# Altium project controller.PrjPcb
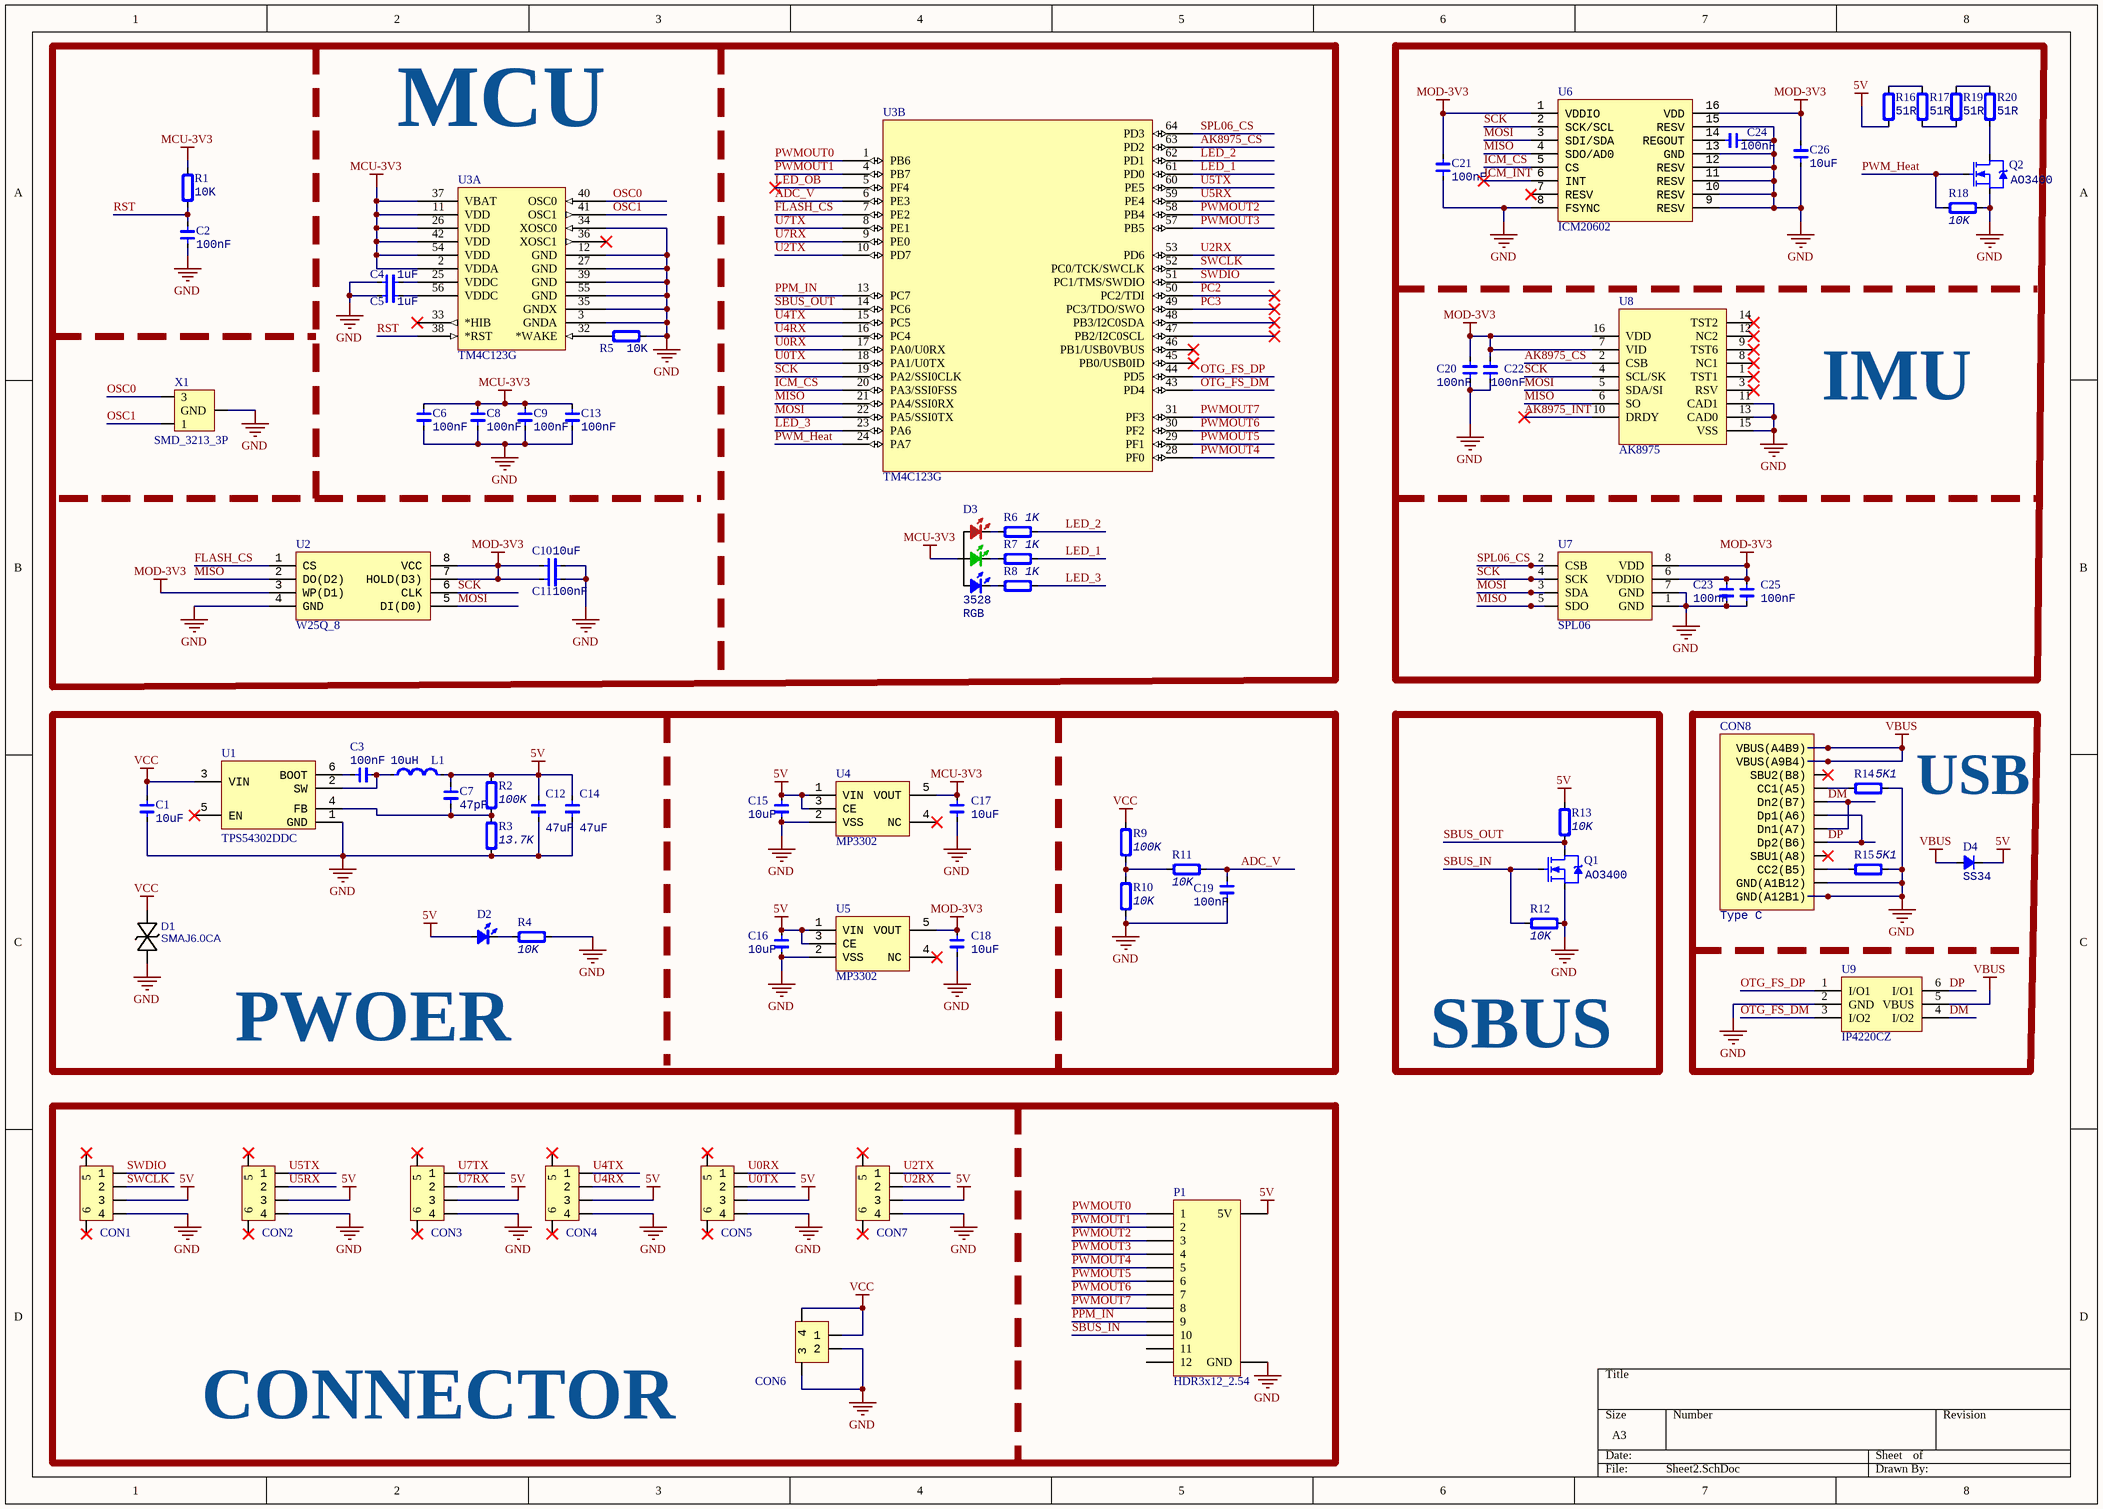
[diagram p0: Sheet2.SchDoc]
1 sheet, 72 parts. Net scope: global (net labels, ports and power ports of the same name join across sheets).
Board file: PCB1.PcbDoc

## Sheet Sheet2.SchDoc
size A3

### Parts
C1  value 10uF  [CAP_0805]  (hidden comment: C0805)
C2  value 100nF  [CAP_0603]  (hidden comment: C0603)
C3  value 100nF  [CAP_0603]  (hidden comment: C0603)
C4  value 1uF  [CAP_0603]  (hidden comment: C0603)
C5  value 1uF  [CAP_0603]  (hidden comment: C0603)
C6  value 100nF  [CAP_0603]  (hidden comment: C0603)
C7  value 47pF  [CAP_0603]  (hidden comment: C0603)
C8  value 100nF  [CAP_0603]  (hidden comment: C0603)
C9  value 100nF  [CAP_0603]  (hidden comment: C0603)
C10  value 10uF  [CAP_0603]  (hidden comment: C0603)
C11  value 100nF  [CAP_0603]  (hidden comment: C0603)
C12  value 47uF  [CAP_0603]  (hidden comment: C0603)
C13  value 100nF  [CAP_0603]  (hidden comment: C0603)
C14  value 47uF  [CAP_0603]  (hidden comment: C0603)
C15  value 10uF  [CAP_0603]  (hidden comment: C0603)
C16  value 10uF  [CAP_0603]  (hidden comment: C0603)
C17  value 10uF  [CAP_0603]  (hidden comment: C0603)
C18  value 10uF  [CAP_0603]  (hidden comment: C0603)
C19  value 100nF  [CAP_0603]  (hidden comment: C0603)
C20  value 100nF  [CAP_0603]  (hidden comment: C0603)
C21  value 100nF  [CAP_0603]  (hidden comment: C0603)
C22  value 100nF  [CAP_0603]  (hidden comment: C0603)
C23  value 100nF  [CAP_0603]  (hidden comment: C0603)
C24  value 100nF  [CAP_0603]  (hidden comment: C0603)
C25  value 100nF  [CAP_0603]  (hidden comment: C0603)
C26  value 10uF  [CAP_0603]  (hidden comment: C0603)
CON1  GH1.25_4P  [GH1.25_4P卧贴]  (value not drawn)
CON2  GH1.25_4P  [GH1.25_4P卧贴]  (value not drawn)
CON3  GH1.25_4P  [GH1.25_4P卧贴]  (value not drawn)
CON4  GH1.25_4P  [GH1.25_4P卧贴]  (value not drawn)
CON5  GH1.25_4P  [GH1.25_4P卧贴]  (value not drawn)
CON6  GH1.25_2P  [GH1.25-2P]  (value not drawn)
CON7  GH1.25_4P  [GH1.25_4P卧贴]  (value not drawn)
CON8  value Type C  [USB_TypeC_SMD_16P]  (hidden comment: USB Type C)
D1  SMAJ6.0CA  [DO-214AC]
D2  D0603  [LED_0603_RED]  (value not drawn)
D3  value RGB  Type: 3528  [LED_3528_RGB]  (hidden comment: D3528)
D4  SS34  [DO-214AC]
L1  value 10uH  [IND_0630]  (hidden comment: H1008)
P1  HDR3x12_2.54  [HDR3x12_2.54]
Q1  AO3400  [SOT23-3]
Q2  AO3400  [SOT23-3]
R1  value 10K  [RES_0603]  (hidden comment: R0603)
R2  value 100K  [RES_0603]  (hidden comment: R0603)
R3  value 13.7K  [RES_0603]  (hidden comment: R0603)
R4  value 10K  [RES_0603]  (hidden comment: R0603)
R5  value 10K  [RES_0603]  (hidden comment: R0603)
R6  value 1K  [RES_0603]  (hidden comment: R0603)
R7  value 1K  [RES_0603]  (hidden comment: R0603)
R8  value 1K  [RES_0603]  (hidden comment: R0603)
R9  value 100K  [RES_0603]  (hidden comment: R0603)
R10  value 10K  [RES_0603]  (hidden comment: R0603)
R11  value 10K  [RES_0603]  (hidden comment: R0603)
R12  value 10K  [RES_0603]  (hidden comment: R0603)
R13  value 10K  [RES_0603]  (hidden comment: R0603)
R14  value 5K1  [RES_0603]  (hidden comment: R0603)
R15  value 5K1  [RES_0603]  (hidden comment: R0603)
R16  value 51R  [RES_0805]  (hidden comment: R0805)
R17  value 51R  [RES_0805]  (hidden comment: R0805)
R18  value 10K  [RES_0603]  (hidden comment: R0603)
R19  value 51R  [RES_0805]  (hidden comment: R0805)
R20  value 51R  [RES_0805]  (hidden comment: R0805)
U1  TPS54302DDC  [SOT23-6]
U2  W25Q_8  [SON_P1.27H_8]
U3  TM4C123G  [LQFP_P0.5_64]  (parts A,B of 2)
U4  MP3302  [SOT23-5]
U5  MP3302  [SOT23-5]
U6  ICM20602  [LGA_P0.5_16]
U7  SPL06  [SMD_8P-2x2.5]
U8  AK8975  [QFN_P0.65_16]
U9  IP4220CZ  [SOT23-6]
X1  SMD_3213_3P  [XT_3213_3]

### Blocks framed on the sheet
MCU: C2 C4-C6 C8-C11 C13 D3 R1 R5-R8 U2 U3 X1
IMU: C20-C26 Q2 R16-R20 U6-U8
PWOER: C1 C3 C7 C12 C14-C19 D1 D2 L1 R2-R4 R9-R11 U1 U4 U5
SBUS: Q1 R12 R13
USB: CON8 D4 R14 R15 U9
CONNECTOR: CON1-CON7 P1

### Nets
5V: C7.1 C12.2 C14.2 C15.2 C16.2 CON1.3 CON2.3 CON3.3 CON4.3 CON5.3 CON7.3 D2.1(A) D4.2(K) L1.2 P1.13(5V) R2.2 R13.2 R16.1 U4.1(VIN) U4.3(CE) U5.1(VIN) U5.3(CE)
GND: C1.1 C2.1 C4.2 C5.2 C6.1 C8.1 C9.1 C10.2 C11.1 C12.1 C13.1 C14.1 C15.1 C16.1 C17.1 C18.1 C19.2 C20.2 C21.2 C22.2 C23.2 C24.1 C25.2 C26.2 CON1.4 CON2.4 CON3.4 CON4.4 CON5.4 CON6.2 CON6.3 CON7.4 CON8.1(GND(A1B12)) CON8.12(GND(A12B1)) D1.1(C) P1.14(GND) Q1.1(S) Q2.1(S) R3.1 R4.2 R5.1 R10.1 R12.2 R14.1 R15.1 R18.2 U1.1(GND) U2.4(GND) U3.3(GNDA) U3.12(GND) U3.27(GND) U3.34(XOSC0) U3.35(GNDX) U3.39(GND) U3.55(GND) U4.2(VSS) U5.2(VSS) U6.8(FSYNC) U6.9(RESV) U6.10(RESV) U6.11(RESV) U6.12(RESV) U6.13(GND) U6.15(RESV) U7.1(GND) U7.7(GND) U8.11(CAD1) U8.13(CAD0) U8.15(VSS) U9.2(GND) X1.2(GND)
MCU-3V3: C6.2 C8.2 C9.2 C13.2 C17.2 D3.4(A) R1.2 U3.2(VDDA) U3.11(VDD) U3.26(VDD) U3.37(VBAT) U3.42(VDD) U3.54(VDD) U4.5(VOUT)
MOD-3V3: C10.1 C11.2 C18.2 C20.1 C21.1 C22.1 C23.1 C25.1 C26.1 U2.3(WP(D1)) U2.7(HOLD(D3)) U2.8(VCC) U5.5(VOUT) U6.1(VDDIO) U6.16(VDD) U7.6(VDDIO) U7.8(VDD) U8.7(VID) U8.16(VDD)
VBUS: CON8.2(VBUS(A4B9)) CON8.11(VBUS(A9B4)) D4.1(A) U9.5(VBUS)
VCC: C1.2 CON6.1 CON6.4 D1.2(A) R9.2 U1.3(VIN)
ADC_V: C19.1 R11.1 U3.6(PE3)
AK8975_CS: U3.63(PD2) U8.2(CSB)
AK8975_INT: U8.10(DRDY)
DM: CON8.5(Dn2(B7)) CON8.7(Dn1(A7)) U9.4(I/O2)
DP: CON8.6(Dp1(A6)) CON8.8(Dp2(B6)) U9.6(I/O1)
FLASH_CS: U2.1(CS) U3.7(PE2)
ICM_CS: U3.20(PA3/SSI0FSS) U6.5(CS)
ICM_INT: U6.6(INT)
LED_1: R7.1 U3.61(PD0)
LED_2: R6.1 U3.62(PD1)
LED_3: R8.1 U3.23(PA6)
LED_OB: U3.5(PF4)
MISO: U2.2(DO(D2)) U3.21(PA4/SSI0RX) U6.4(SDO/AD0) U7.5(SDO) U8.6(SO)
MOSI: U2.5(DI(D0)) U3.22(PA5/SSI0TX) U6.3(SDI/SDA) U7.3(SDA) U8.5(SDA/SI)
OSC0: U3.40(OSC0) X1.3
OSC1: U3.41(OSC1) X1.1
OTG_FS_DM: U3.43(PD4) U9.3(I/O2)
OTG_FS_DP: U3.44(PD5) U9.1(I/O1)
PC2: U3.50(PC2/TDI)
PC3: U3.49(PC3/TDO/SWO)
PPM_IN: P1.9 U3.13(PC7)
PWM_Heat: Q2.2(G) R18.1 U3.24(PA7)
PWMOUT0: P1.1 U3.1(PB6)
PWMOUT1: P1.2 U3.4(PB7)
PWMOUT2: P1.3 U3.58(PB4)
PWMOUT3: P1.4 U3.57(PB5)
PWMOUT4: P1.5 U3.28(PF0)
PWMOUT5: P1.6 U3.29(PF1)
PWMOUT6: P1.7 U3.30(PF2)
PWMOUT7: P1.8 U3.31(PF3)
RST: C2.2 R1.1 U3.38(*RST)
SBUS_IN: P1.10 Q1.2(G) R12.1
SBUS_OUT: Q1.3(D) R13.1 U3.14(PC6)
SCK: U2.6(CLK) U3.19(PA2/SSI0CLK) U6.2(SCK/SCL) U7.4(SCK) U8.4(SCL/SK)
SPL06_CS: U3.64(PD3) U7.2(CSB)
SWCLK: CON1.2 U3.52(PC0/TCK/SWCLK)
SWDIO: CON1.1 U3.51(PC1/TMS/SWDIO)
U0RX: CON5.1 U3.17(PA0/U0RX)
U0TX: CON5.2 U3.18(PA1/U0TX)
U2RX: CON7.2 U3.53(PD6)
U2TX: CON7.1 U3.10(PD7)
U4RX: CON4.2 U3.16(PC4)
U4TX: CON4.1 U3.15(PC5)
U5RX: CON2.2 U3.59(PE4)
U5TX: CON2.1 U3.60(PE5)
U7RX: CON3.2 U3.9(PE0)
U7TX: CON3.1 U3.8(PE1)
NetC3_1: C3.1 L1.1 U1.2(SW)
NetC3_2: C3.2 U1.6(BOOT)
NetC4_1: C4.1 U3.25(VDDC)
NetC5_1: C5.1 U3.56(VDDC)
NetC7_2: C7.2 R2.1 R3.2 U1.4(FB)
NetC24_2: C24.2 U6.14(REGOUT)
NetCON8_4: CON8.4(CC1(A5)) R14.2
NetCON8_10: CON8.10(CC2(B5)) R15.2
NetD2_2: D2.2(K) R4.1
NetD3_1: D3.1(R) R6.2
NetD3_2: D3.2(G) R7.2
NetD3_3: D3.3(B) R8.2
NetQ2_3: Q2.3(D) R20.1
NetR5_2: R5.2 U3.32(*WAKE)
NetR9_1: R9.1 R10.2 R11.2
NetR16_2: R16.2 R17.2
NetR17_1: R17.1 R19.1
NetR19_2: R19.2 R20.2

Not connected (* = marked no-connect by the designer): CON1 5* 6*; CON2 5* 6*; CON3 5* 6*; CON4 5* 6*; CON5 5* 6*; CON7 5* 6*; CON8 0(SH) 3(SBU2(B8))* 9(SBU1(A8))*; P1 11 12; U1 5(EN)* 7; U3 33(*HIB)* 36(XOSC1)* 45(PB0/USB0ID)* 46(PB1/USB0VBUS)* 47(PB2/I2C0SCL)* 48(PB3/I2C0SDA)*; U4 4(NC)*; U5 4(NC)*; U6 7(RESV)*; U8 1(TST1)* 3(RSV)* 8(NC1)* 9(TST6)* 12(NC2)* 14(TST2)*

### Library data of the parts
C1 = Cap_0805: Capacitor; Specification: X7R, ±10%, 16V; Manufacturer: *
C2-C26 = Cap_0603: Capacitor; Specification: X7R, ±10%, 16V; Manufacturer: *
CON1-CON5 CON7 = GH1.25_4P: GH
CON6 = GH1.25_2P: GH
CON8 = USB_TypeC_16P: USB; Type: *
D1 = SMAJ6.0CA: SMAJ6.0CA_C698928; BOM_Manufacturer: Yangzhou Yangjie Elec Tech; Contributor: LCSC; BOM_Supplier: LCSC; BOM_Supplier Part: C698928; BOM_Manufacturer Part: SMAJ6.0CA; BOM_JLCPCB Part Class: Extended Part; spicePre: D; spiceSymbolName: SMAJ6.0CA_C698928
D2 = LED_0603: LED; Manufacturer: *; Specification: *; Note: *
D3 = LED_3528_RGB: LED; Manufacturer: *; Specification: *; Note: *
D4 = Diode_SMA: Diode; Type: SMA; Manufacturer: *; Specification: *; Note: *; Value: SS34
L1 = Ind_0630: Inductor; Specification: High frequency chip inductor ±5%; Manufacturer: *
Q1 Q2 = MOSFET_N: MOSFET; Note: NMOS; Manufacturer: *; Specification: *; Value: AO3400
R1-R15 R18 = Res_0603: Resistor; Specification: ±1%; Manufacturer: *
  R2-R4 R6-R15 R18: Note: ±1%; Type: 0603
R16 R17 R19 R20 = Res_0805: Resistor; Specification: ±1%; Manufacturer: *
U1 = TPS54302DDC: Power; Type: *; Value: *
U2 = W25Q_8: FLASH
U4 U5 = HX9133: WLED Driver
U6 = ICM20602: Sensor Motion; Type: LGA16 P0.5
U9 = USB_ESD
X1 = SMD_3213_3P: Crystal Oscillator